# EAGLE design L9110_v1_1 (EAGLE 9.6.2)
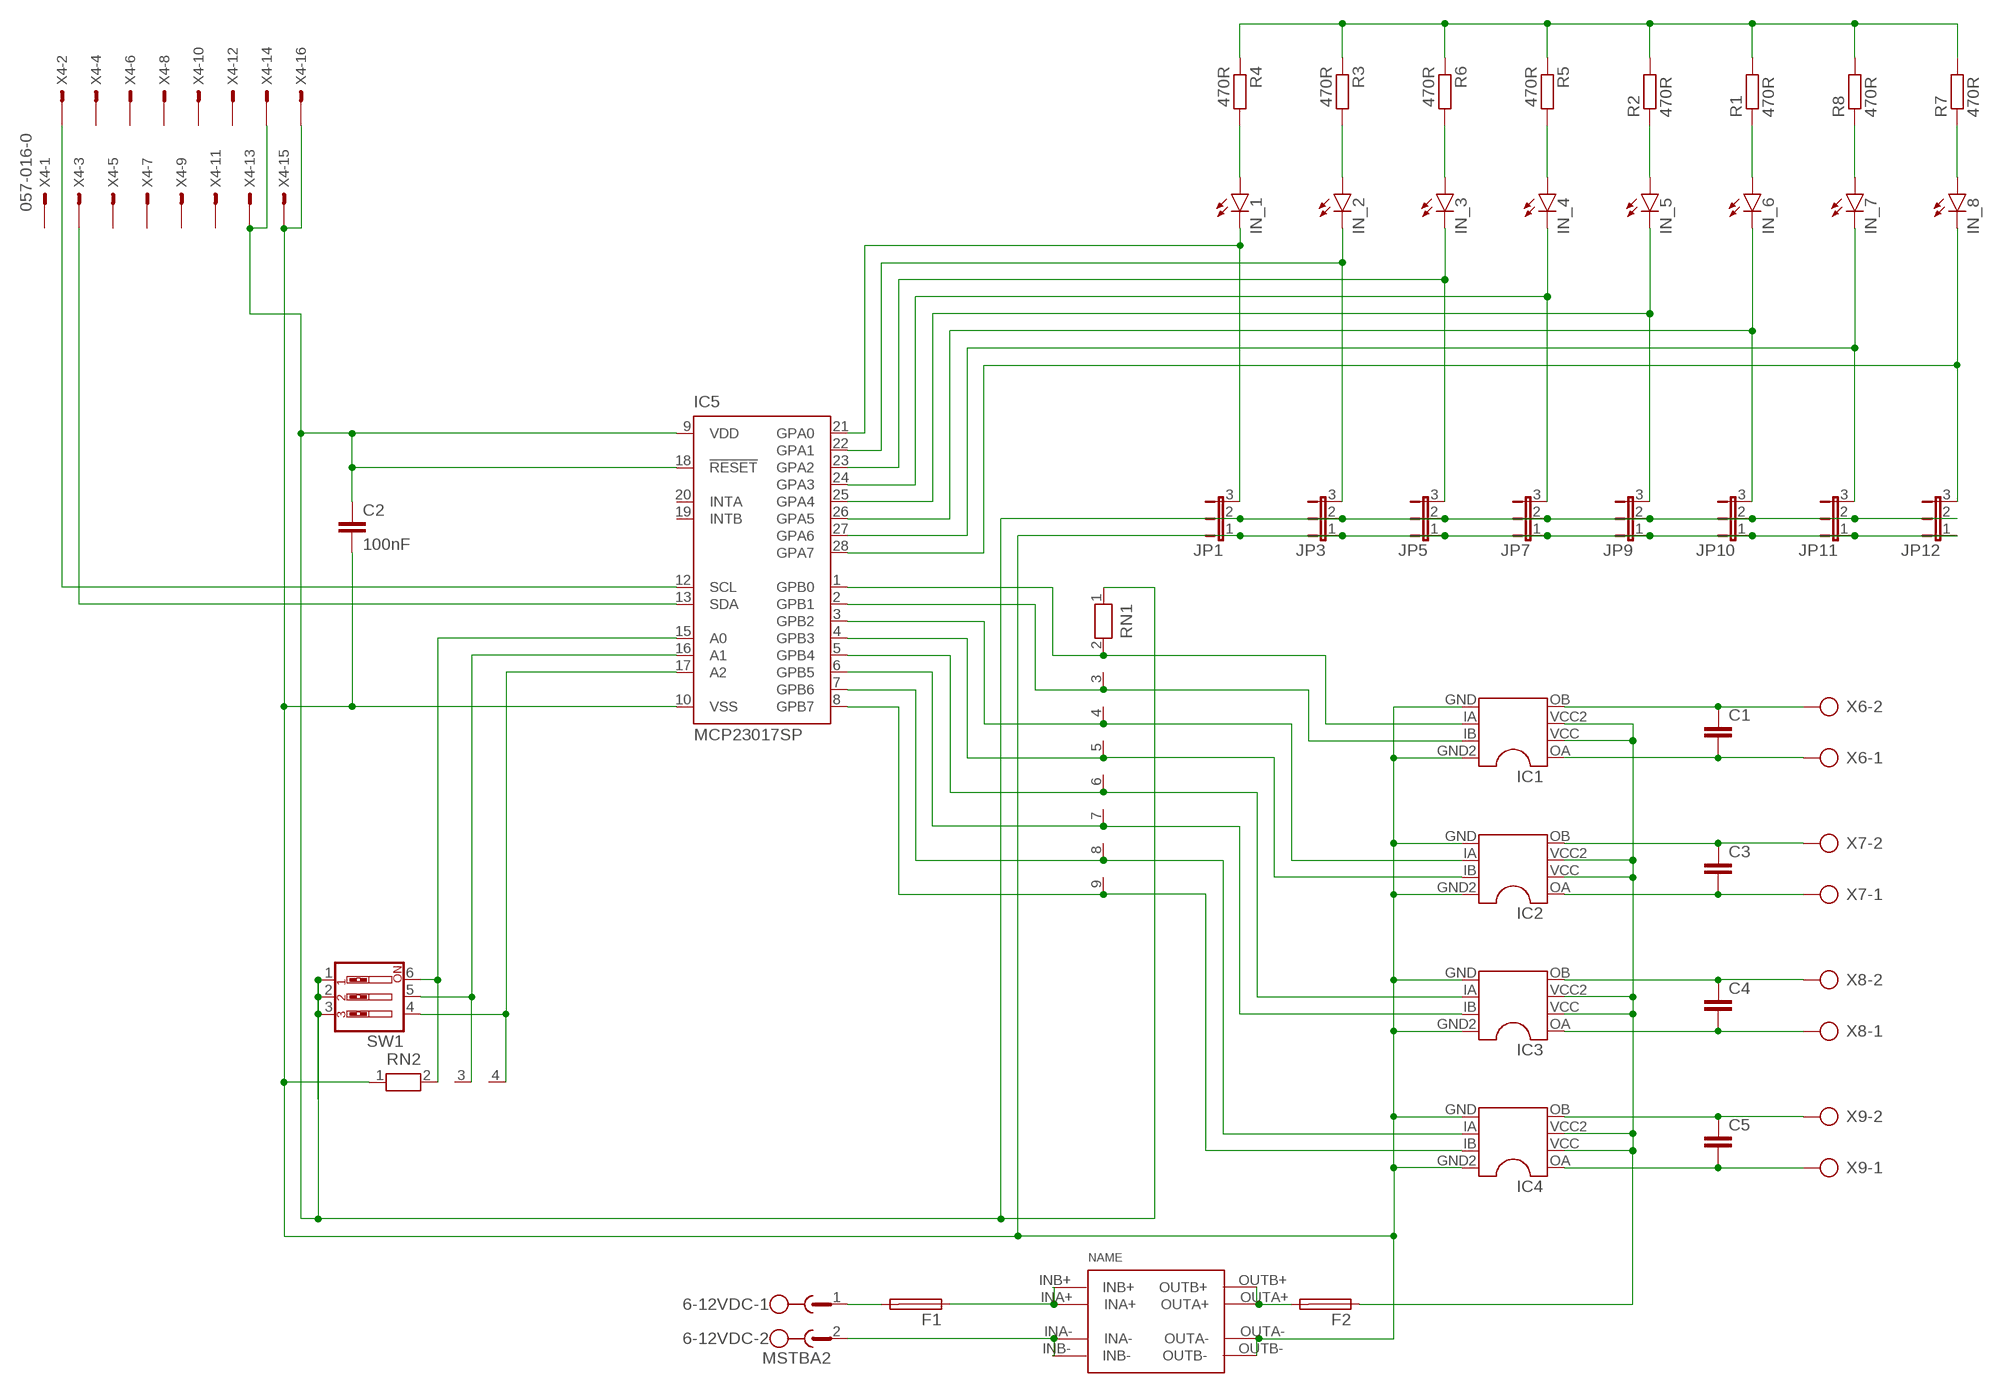
[diagram p0: schematic, sheet 1]

## Parts
6-12VDC  MSTBA2  [MSTBA2]
C1  C-EU025-024X044  [C025-024X044]
C2  100nF  C-EU025-024X044  [C025-024X044]
C3  C-EU025-024X044  [C025-024X044]
C4  C-EU025-024X044  [C025-024X044]
C5  C-EU025-024X044  [C025-024X044]
F1  SH22,5A  [SH22,5A]
F2  SH22,5A  [SH22,5A]
IC1  L9110  [L9110]
IC2  L9110  [L9110]
IC3  L9110  [L9110]
IC4  L9110  [L9110]
IC5  MCP23017SP  [DIL28-3]
IN_1  LED3MM  [LED3MM]
IN_2  LED3MM  [LED3MM]
IN_3  LED3MM  [LED3MM]
IN_4  LED3MM  [LED3MM]
IN_5  LED3MM  [LED3MM]
IN_6  LED3MM  [LED3MM]
IN_7  LED3MM  [LED3MM]
IN_8  LED3MM  [LED3MM]
JP1  JP2E  [JP2]
JP3  JP2E  [JP2]
JP5  JP2E  [JP2]
JP7  JP2E  [JP2]
JP9  JP2E  [JP2]
JP10  JP2E  [JP2]
JP11  JP2E  [JP2]
JP12  JP2E  [JP2]
R1  470R  R-EU_0309/10  [0309/10]
R2  470R  R-EU_0309/10  [0309/10]
R3  470R  R-EU_0309/10  [0309/10]
R4  470R  R-EU_0309/10  [0309/10]
R5  470R  R-EU_0309/10  [0309/10]
R6  470R  R-EU_0309/10  [0309/10]
R7  470R  R-EU_0309/10  [0309/10]
R8  470R  R-EU_0309/10  [0309/10]
RN1  RN08  [RN-9]
RN2  RN03  [RN-3]
SW1  SW_DIP-3  [EDG-03]
U$2  CP8-ADJ-B  [CP8-ADJ-B]
X4  057-016-0  [057-016-0]
X6  AK300/2  [AK300/2]
X7  AK300/2  [AK300/2]
X8  AK300/2  [AK300/2]
X9  AK300/2  [AK300/2]

## Nets
GND2: C2.2 IC1.GND IC1.GND2 IC2.GND IC2.GND2 IC3.GND IC3.GND2 IC4.GND IC4.GND2 IC5.10(VSS) JP1.1 JP3.1 JP5.1 JP7.1 JP9.1 JP10.1 JP11.1 JP12.1 RN2.1 U$2.OUTA- U$2.OUTB- X4.15 X4.16
N$1: IC1.IA IC5.1(GPB0) RN1.2
N$2: IC5.22(GPA1) IN_2.K(C) JP3.3
N$3: IC1.IB IC5.2(GPB1) RN1.3
N$4: IC5.24(GPA3) IN_4.K(C) JP7.3
N$5: IC2.IA IC5.3(GPB2) RN1.4
N$6: IC5.17(A2) RN2.4 SW1.4
N$7: IC5.26(GPA5) IN_6.K(C) JP10.3
N$8: IC2.IB IC5.4(GPB3) RN1.5
N$9: IC5.28(GPA7) IN_8.K(C) JP12.3
N$10: IN_8.A R7.1
N$11: IN_7.A R8.1
N$12: IC3.IA IC5.5(GPB4) RN1.6
N$13: IN_6.A R1.1
N$14: IC3.IB IC5.6(GPB5) RN1.7
N$15: IC4.IA IC5.7(GPB6) RN1.8
N$16: IC4.IB IC5.8(GPB7) RN1.9
N$17: C1.1 IC1.OB X6.2
N$18: F2.1 IC1.VCC IC1.VCC2 IC2.VCC IC2.VCC2 IC3.VCC IC3.VCC2 IC4.VCC IC4.VCC2
N$19: C1.2 IC1.OA X6.1
N$20: C3.1 IC2.OB X7.2
N$21: IC5.21(GPA0) IN_1.K(C) JP1.3
N$22: C3.2 IC2.OA X7.1
N$23: IC5.23(GPA2) IN_3.K(C) JP5.3
N$24: C4.1 IC3.OB X8.2
N$25: IC5.25(GPA4) IN_5.K(C) JP9.3
N$26: C4.2 IC3.OA X8.1
N$27: IC5.27(GPA6) IN_7.K(C) JP11.3
N$28: C5.1 IC4.OB X9.2
N$29: IN_5.A R2.1
N$30: IN_4.A R5.2
N$31: IN_3.A R6.2
N$32: IN_2.A R3.2
N$33: IN_1.A R4.2
N$34: C5.2 IC4.OA X9.1
N$35: IC5.16(A1) RN2.3 SW1.5
N$36: 6-12VDC.1 F1.2
N$37: F1.1 U$2.INA+ U$2.INB+
N$38: 6-12VDC.2 U$2.INA- U$2.INB-
N$39: F2.2 U$2.OUTA+ U$2.OUTB+
N$82: IC5.12(SCL) X4.2
N$84: IC5.13(SDA) X4.3
N$85: IC5.15(A0) RN2.2 SW1.6
VCC5.1: C2.1 IC5.9(VDD) IC5.18(!RESET) JP1.2 JP3.2 JP5.2 JP7.2 JP9.2 JP10.2 JP11.2 JP12.2 RN1.1 SW1.1 SW1.2 SW1.3 X4.13 X4.14
VCC5.2: R1.2 R2.2 R3.1 R4.1 R5.1 R6.1 R7.2 R8.2
Unconnected: IC5.19(INTB) IC5.20(INTA) X4.1 X4.4 X4.5 X4.6 X4.7 X4.8 X4.9 X4.10 X4.11 X4.12

## Library data of the parts
6-12VDC = con-phoenix-508:MSTBA2: PHOENIX; MF: FARNELL; MPN: 1757242; OC_FARNELL: 3705171; OC_NEWARK: 71C4161
C1-C5 = resistor:C-EU: CAPACITOR, European symbol
F1 F2 = fuse:SH22,5A: FUSE HOLDER grid 22,5mm, isolated cap OGN0031 8201, Schurter (Buerklin); MPN: 0031.7701.11; OC_FARNELL: unknown; OC_NEWARK: 04F1224
IC1-IC4 = kevin:L9110: Dual In Line / Socket
IC5 = microchip-6:MCP23017: http://ww1.microchip.com/downloads/en/DeviceDoc/21952a.pdf Source: http://ww1.microchip.com/downloads/en/DeviceDoc/21952a.pdf
IN_1-IN_8 = led:LED: LED OSRAM: - CHIPLED LG R971, LG N971, LY N971, LG Q971, LY Q971, LO R971, LY R971 LH N974, LH R974 LS Q976, LO Q976, LY Q976 LO Q996 - Hyper CHIPLED LW Q18S LB Q993, LB Q99A, LB R99A - SideLED LS A670, LO A670, LY A670, LG A670, LP A670 LB A673, LV A673, LT A673, LW A673 LH A674 LY A675 LS A676, LA A676, LO A676, LY A676, LW A676 LS A679, LY A679, LG A679 - Hyper Micro SIDELED® LS Y876, LA Y876, LO Y876, LY Y876 LT Y87S - SmartLED LW L88C, LW L88S LB L89C, LB L89S, LG L890 LS L89K, LO L89K, LY L89K LS L896, LA L896, LO L896, LY L896 - TOPLED LS T670, LO T670, LY T670, LG T670, LP T670 LSG T670, LSP T670, LSY T670, LOP T670, LYG T670 LG T671, LOG T671, LSG T671 LB T673, LV T673, LT T673, LW T673 LH T674 LS T676, LA T676, LO T676, LY T676, LB T676, LH T676, LSB T676, LW T676 LB T67C, LV T67C, LT T67C, LS T67K, LO T67K, LY T67K, LW E67C LS E67B, LA E67B, LO E67B, LY E67B, LB E67C, LV E67C, LT E67C LW T67C LS T679, LY T679, LG T679 LS T770, LO T770, LY T770, LG T770, LP T770 LB T773, LV T773, LT T773, LW T773 LH T774 LS E675, LA E675, LY E675, LS T675 LS T776, LA T776, LO T776, LY T776, LB T776 LHGB T686 LT T68C, LB T68C - Hyper Mini TOPLED® LB M676 - Mini TOPLED Santana® LG M470 LS M47K, LO M47K, LY M47K Source: http://www.osram.convergy.de LUXEON: - LUMILED® LXK2-PW12-R00, LXK2-PW12-S00, LXK2-PW14-U00, LXK2-PW14-V00 LXK2-PM12-R00, LXK2-PM12-S00, LXK2-PM14-U00 LXK2-PE12-Q00, LXK2-PE12-R00, LXK2-PE12-S00, LXK2-PE14-T00, LXK2-PE14-U00 LXK2-PB12-K00, LXK2-PB12-L00, LXK2-PB12-M00, LXK2-PB14-N00, LXK2-PB14-P00, LXK2-PB14-Q00 LXK2-PR12-L00, LXK2-PR12-M00, LXK2-PR14-Q00, LXK2-PR14-R00 LXK2-PD12-Q00, LXK2-PD12-R00, LXK2-PD12-S00 LXK2-PH12-R00, LXK2-PH12-S00 LXK2-PL12-P00, LXK2-PL12-Q00, LXK2-PL12-R00 Source: www.luxeon.com KINGBRIGHT: KA-3528ASYC Source: www.kingbright.com
JP1 JP3 JP5 JP7 JP9-JP12 = jumper:JP2E: JUMPER
R1-R8 = resistor:R-EU_: RESISTOR, European symbol
RN1 = resistor-net_edit:RN08: RESISTOR NETWORK; OC_FARNELL: unknown; OC_NEWARK: unknown
RN2 = resistor-net_edit:RN03: RESISTOR NETWORK; OC_FARNELL: unknown; OC_NEWARK: unknown
SW1 = special:SW_DIP-3: DIP SWITCH
U$2 = userlib:CP8-ADJ-B: Voltage regulator IN: 7-35V OUT: ADJ
X4 = con-panduit:057-016-: CONNECTOR 10-pin series 057 contact pc board low profile headers; OC_FARNELL: unknown; OC_NEWARK: unknown
X6-X9 = con-ptr500:AK300/2: CONNECTOR; OC_FARNELL: unknown; OC_NEWARK: unknown

## Board
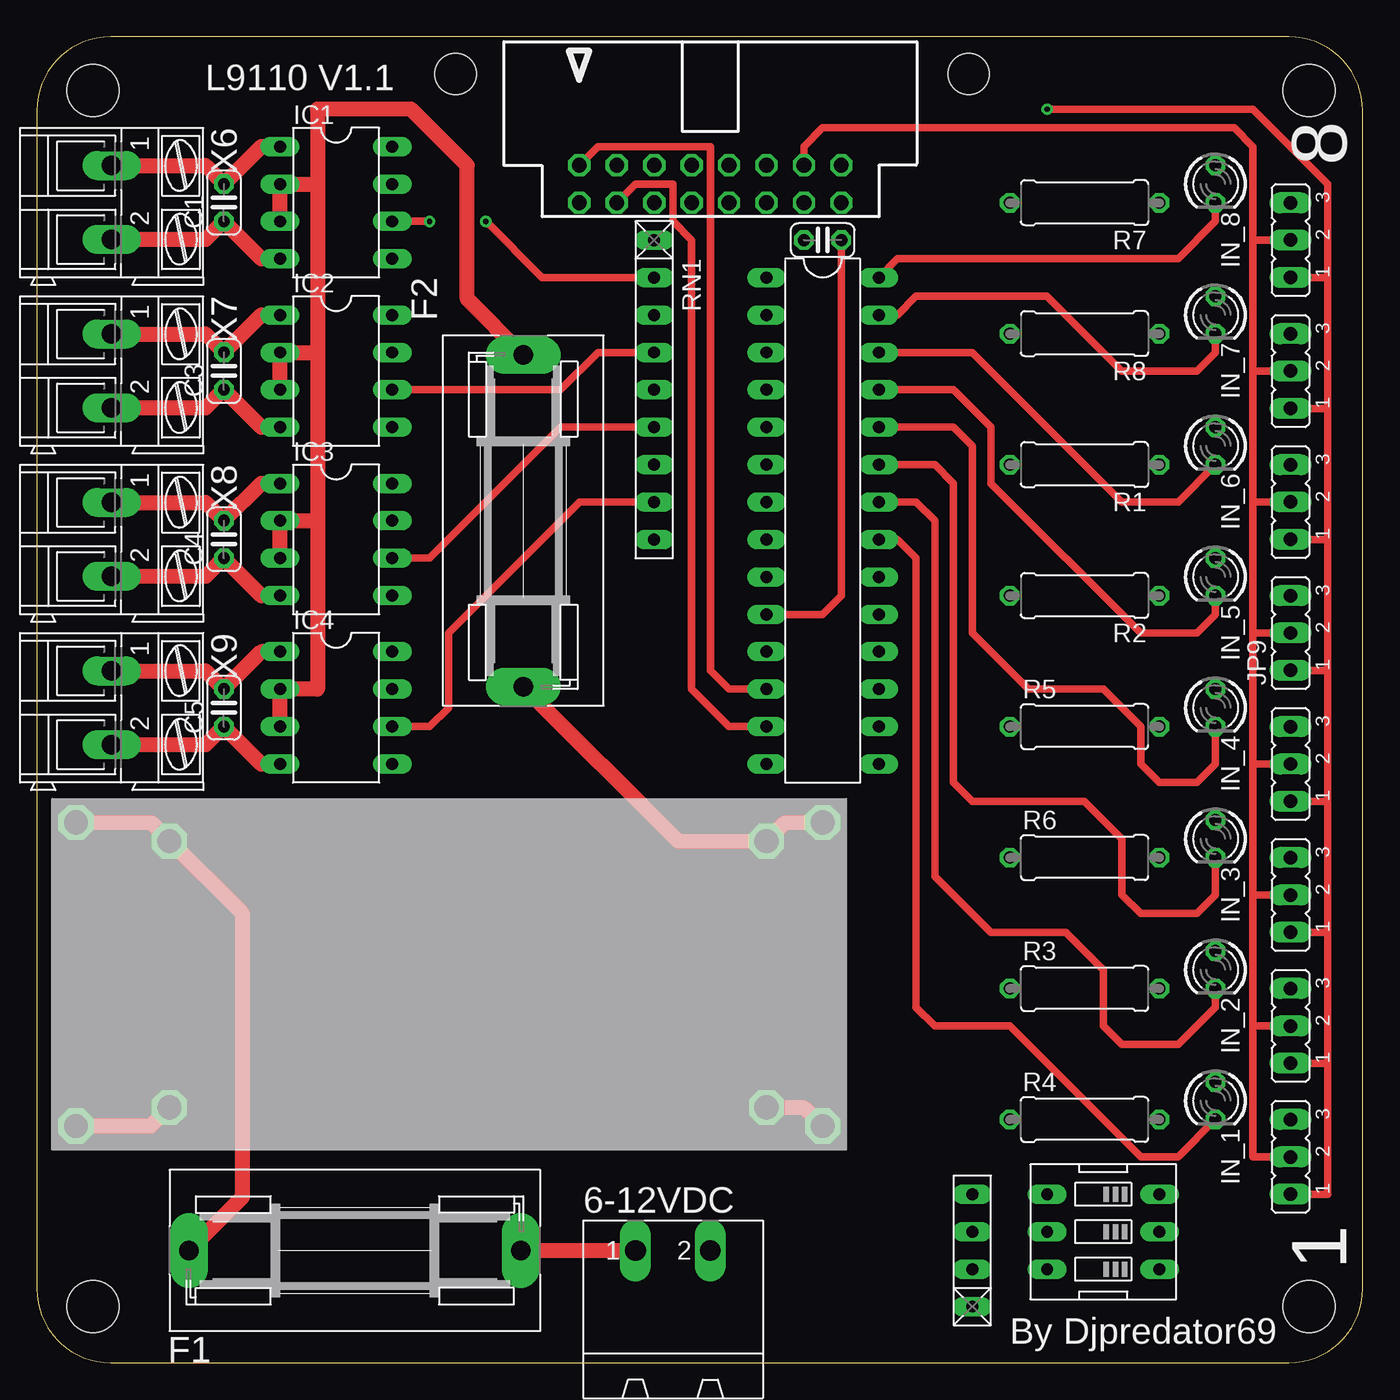
[diagram p1: board, top side]
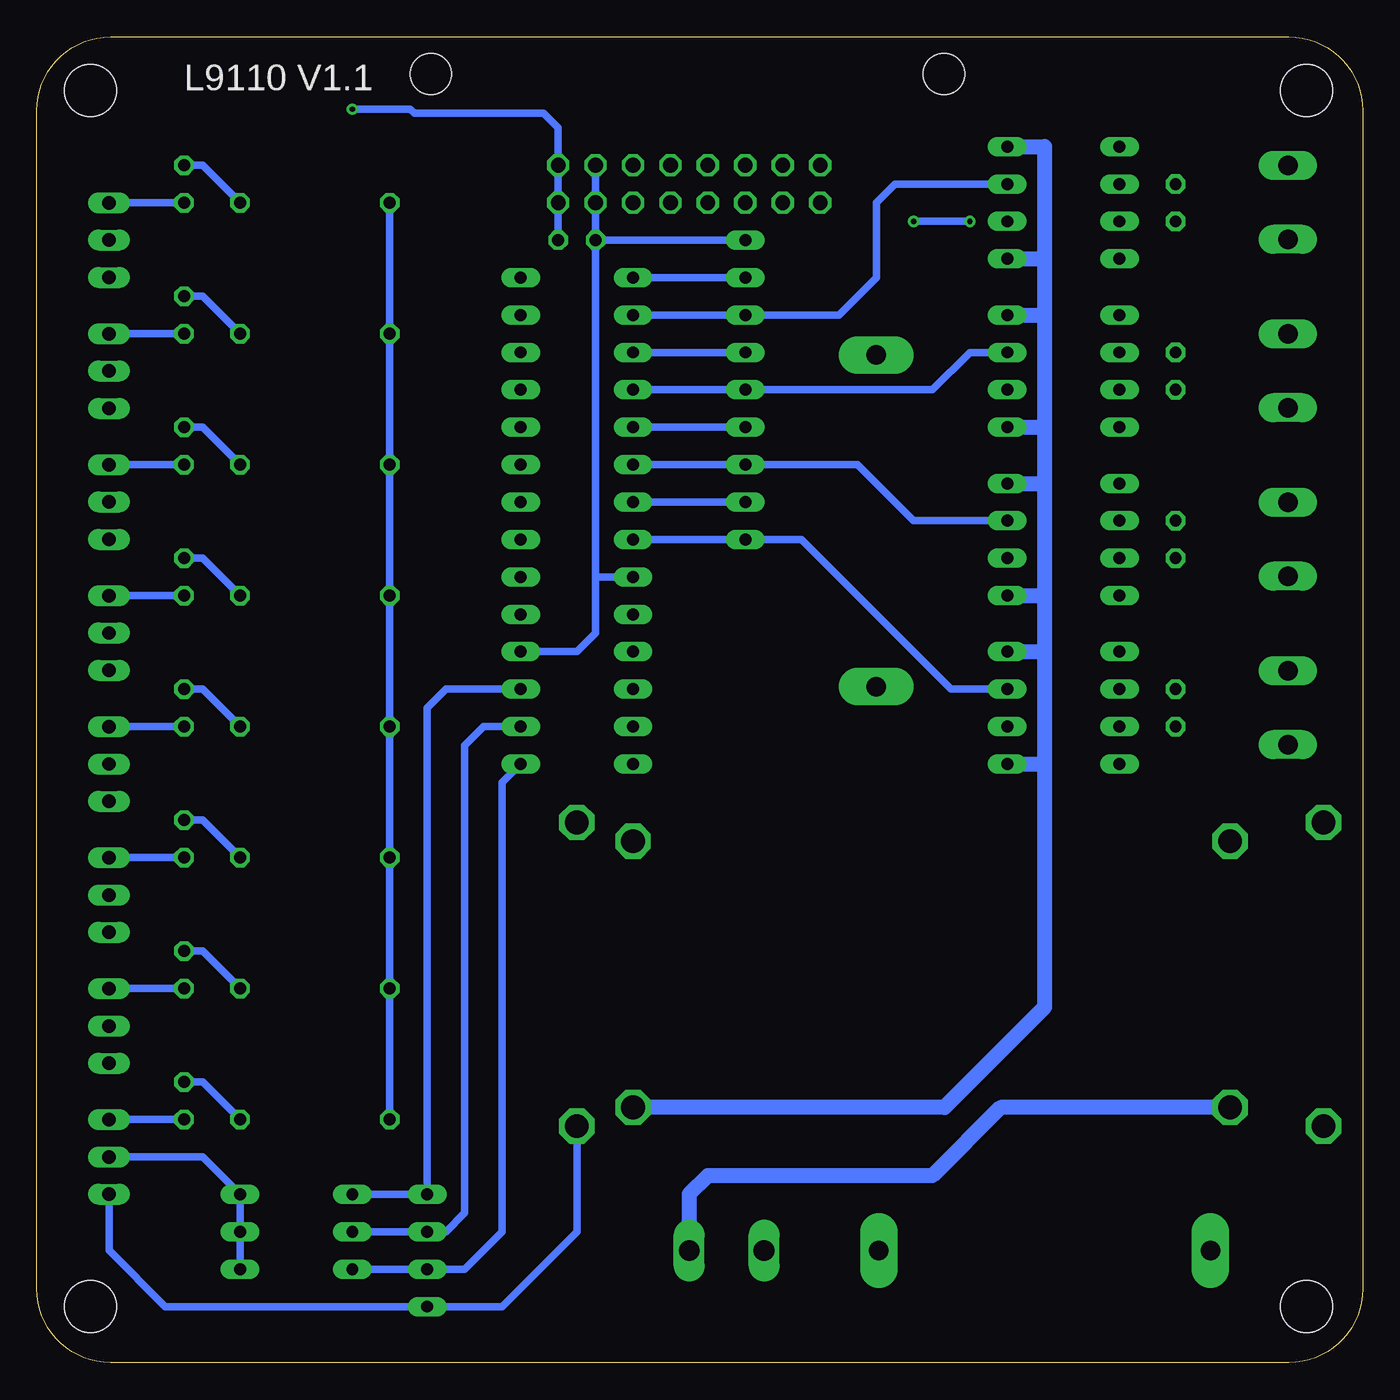
[diagram p2: board, bottom side, seen from below]

Size 90 x 90 mm. Coordinates in mm from the lower left corner, seen from the top.
Outline: 0,85 0,5 arc90 5,0 85,0 arc90 90,5 90,85 arc90 85,90 5,90 arc90 0,85
Copper layers (1*16): Top 0.035mm / dielectric 1.5mm / Bottom 0.035mm
Design rules "default": minimum track width 6mil, minimum drill 0.35mm, track to track 6mil, track to pad 6mil, pad to pad 6mil, via to via 6mil, smd to smd 6mil, copper to edge 40mil, drill to drill 6mil, minimum pad ring 10mil, minimum via ring 8mil, stop-mask expansion 4mil, vias tented up to drill 0mil, thermal gap 10mil
Holes 3.5 mm at 86.36,86.36 3.81,86.36 3.81,3.81 86.36,3.81

### Footprints (pad centres in the part's own frame; a part is rotated, then mirrored left to right if it is on the bottom)
MSTBA2 = drill 1.397 long: 1 -2.54,5.08; 2 2.54,5.08
C025-024X044 = drill 0.813 octagon: 1 -1.27,0; 2 1.27,0
SH22,5A = drill 1.321 pad 2.54 long: 1 -11.252,0; 2 11.252,0
L9110 = drill 0.813 long: GND 3.81,3.81; GND2 -3.81,3.81; IA 1.27,3.81; IB -1.27,3.81; OA -3.81,-3.81; OB 3.81,-3.81; VCC -1.27,-3.81; VCC2 1.27,-3.81
DIL28-3 = drill 0.813 long: 1 -16.51,-3.81; 2 -13.97,-3.81; 3 -11.43,-3.81; 4 -8.89,-3.81; 5 -6.35,-3.81; 6 -3.81,-3.81; 7 -1.27,-3.81; 8 1.27,-3.81; 9 3.81,-3.81; 10 6.35,-3.81; 11 8.89,-3.81; 12 11.43,-3.81; 13 13.97,-3.81; 14 16.51,-3.81; 15 16.51,3.81; 16 13.97,3.81; 17 11.43,3.81; 18 8.89,3.81; 19 6.35,3.81; 20 3.81,3.81; 21 1.27,3.81; 22 -1.27,3.81; 23 -3.81,3.81; 24 -6.35,3.81; 25 -8.89,3.81; 26 -11.43,3.81; 27 -13.97,3.81; 28 -16.51,3.81
LED3MM = drill 0.813 octagon: A -1.27,0; K 1.27,0
JP2 = drill 0.914 long: 1 -2.54,0; 2 0,0; 3 2.54,0
0309/10 = drill 0.813 octagon: 1 -5.08,0; 2 5.08,0
RN-9 = drill 0.813 long: 1 -10.16,0; 2 -7.62,0; 3 -5.08,0; 4 -2.54,0; 5 0,0; 6 2.54,0; 7 5.08,0; 8 7.62,0; 9 10.16,0
RN-3 = drill 0.813 long: 1 -5.08,0; 2 -2.54,0; 3 0,0; 4 2.54,0
EDG-03 = drill 0.813 long: 1 -2.54,-3.81; 2 0,-3.81; 3 2.54,-3.81; 4 2.54,3.81; 5 0,3.81; 6 -2.54,3.81
CP8-ADJ-B = drill 1.6 octagon: INA+ -19.27,8.32; INA- -19.27,-9.75; INB+ -25.62,9.59; INB- -25.62,-11.02; OUTA+ 21.26,8.32; OUTA- 21.26,-9.75; OUTB+ 25.07,9.59; OUTB- 25.07,-11.02
057-016-0 = drill 1 octagon: 1 -8.89,-5.08; 2 -8.89,-2.54; 3 -6.35,-5.08; 4 -6.35,-2.54; 5 -3.81,-5.08; 6 -3.81,-2.54; 7 -1.27,-5.08; 8 -1.27,-2.54; 9 1.27,-5.08; 10 1.27,-2.54; 11 3.81,-5.08; 12 3.81,-2.54; 13 6.35,-5.08; 14 6.35,-2.54; 15 8.89,-5.08; 16 8.89,-2.54 | hole 2.8: -17.29,3.66; 17.54,3.66
AK300/2 = drill 1.321 long: 1 -2.515,0; 2 2.489,0

### Placement (x,y rotation side)
6-12VDC  43.18,2.54 0 top
C1  12.7,78.74 90 top
C2  53.34,76.2 0 top
C3  12.7,67.31 90 top
C4  12.7,55.88 90 top
C5  12.7,44.45 90 top
F1  21.59,7.62 0 top
F2  33.02,57.15 270 top
IC1  20.32,78.74 270 top
IC2  20.32,67.31 270 top
IC3  20.32,55.88 270 top
IC4  20.32,44.45 270 top
IC5  53.34,57.15 270 top
IN_1  80.01,17.78 270 top
IN_2  80.01,26.67 270 top
IN_3  80.01,35.56 270 top
IN_4  80.01,44.45 270 top
IN_5  80.01,53.34 270 top
IN_6  80.01,62.23 270 top
IN_7  80.01,71.12 270 top
IN_8  80.01,80.01 270 top
JP1  85.09,13.97 90 top
JP3  85.09,22.86 90 top
JP5  85.09,31.75 90 top
JP7  85.09,40.64 90 top
JP9  85.09,49.53 90 top
JP10  85.09,58.42 90 top
JP11  85.09,67.31 90 top
JP12  85.09,76.2 90 top
R1  71.12,60.96 180 top
R2  71.12,52.07 180 top
R3  71.12,25.4 0 top
R4  71.12,16.51 0 top
R5  71.12,43.18 0 top
R6  71.12,34.29 0 top
R7  71.12,78.74 180 top
R8  71.12,69.85 180 top
RN1  41.91,66.04 270 top
RN2  63.5,8.89 90 top
SW1  72.39,8.89 90 top
U$2  28.27,27.08 0 top
X4  45.72,83.82 0 top
X6  5.08,78.74 270 top
X7  5.08,67.31 270 top
X8  5.08,55.88 270 top
X9  5.08,44.45 270 top

### Tracks (layer width: path | path; a pad name or v marks a point on that pad's centre or on a via)
GND2  (via drill 0.35)
  Top 0.508: JP1.1 87.63,11.43 87.63,20.32 | 87.63,20.32 87.63,29.21 | 87.63,29.21 87.63,38.1 | 87.63,38.1 87.63,46.99 | 87.63,46.99 87.63,55.88 | 87.63,55.88 87.63,64.77 | 87.63,64.77 87.63,73.66 | 87.63,73.66 JP12.1 | JP11.1 87.63,64.77 | JP10.1 87.63,55.88 | JP9.1 87.63,46.99 | JP7.1 87.63,38.1 | JP5.1 87.63,29.21 | JP3.1 87.63,20.32 | 87.63,73.66 87.63,80.01 82.55,85.09 v68.58,85.09 | IC5.10 53.34,50.8 54.61,52.07 C2.2
  Top 1.016: U$2.OUTA- 52.07,17.33 U$2.OUTB-
  Bottom 0.508: U$2.OUTB- 53.34,8.89 58.42,3.81 RN2.1 81.28,3.81 85.09,7.62 JP1.1 | C2.2 X4.15 X4.16 54.61,83.82 55.6,84.81 64.37,84.81 64.65,85.09 v68.58,85.09
  Bottom 1.016: IC1.GND2 21.59,82.55 21.59,74.93 | 21.59,74.93 21.59,71.12 | 21.59,71.12 21.59,63.5 | 21.59,63.5 21.59,59.69 | 21.59,59.69 21.59,52.07 | 21.59,52.07 21.59,48.26 | 21.59,48.26 21.59,40.64 | IC1.GND 21.59,74.93 | IC2.GND2 21.59,71.12 | IC2.GND 21.59,63.5 | IC3.GND2 21.59,59.69 | IC3.GND 21.59,52.07 | IC4.GND2 21.59,48.26 | IC4.GND 21.59,40.64 | 21.59,40.64 21.59,24.13 28.39,17.33 U$2.OUTA-
N$1  (via drill 0.35)
  Top 0.508: IC1.IA v26.67,77.47 | v30.48,77.47 34.29,73.66 RN1.2
  Bottom 0.508: RN1.2 IC5.1 | v26.67,77.47 v30.48,77.47
N$2
  Top 0.508: IC5.22 59.69,58.42 60.96,57.15 60.96,33.02 64.77,29.21 69.85,29.21 72.39,26.67 72.39,22.86 73.66,21.59 77.47,21.59 80.01,24.13 IN_2.K
  Bottom 0.508: IN_2.K JP3.3
N$3
  Bottom 0.508: IC5.2 RN1.3 35.56,71.12 33.02,73.66 33.02,78.74 31.75,80.01 IC1.IB
N$4
  Top 0.508: IC5.24 62.23,63.5 63.5,62.23 63.5,49.53 67.31,45.72 72.39,45.72 74.93,43.18 74.93,40.64 76.2,39.37 78.74,39.37 80.01,40.64 IN_4.K
  Bottom 0.508: IN_4.K JP7.3
N$5
  Top 0.508: IC2.IA 35.56,66.04 38.1,68.58 RN1.4
  Bottom 0.508: RN1.4 IC5.3
N$6
  Bottom 0.508: SW1.4 RN2.4 63.5,44.45 62.23,45.72 IC5.17
N$7
  Top 0.508: IC5.26 63.5,68.58 73.66,58.42 77.47,58.42 IN_6.K
  Bottom 0.508: IN_6.K JP10.3
N$8
  Bottom 0.508: IC5.4 RN1.5 29.21,66.04 26.67,68.58 IC2.IB
N$9
  Top 0.508: IC5.28 58.42,74.93 77.47,74.93 80.01,77.47 IN_8.K
  Bottom 0.508: IN_8.K JP12.3
N$10
  Bottom 0.508: R7.1 78.74,81.28 IN_8.A
N$11
  Bottom 0.508: R8.1 78.74,72.39 IN_7.A
N$12
  Top 0.508: IC3.IA 26.67,54.61 35.56,63.5 RN1.6
  Bottom 0.508: RN1.6 IC5.5
N$13
  Bottom 0.508: R1.1 78.74,63.5 IN_6.A
N$14
  Bottom 0.508: IC5.6 RN1.7 34.29,60.96 30.48,57.15 IC3.IB
N$15
  Top 0.508: RN1.8 39.37,58.42 38.1,58.42 36.83,58.42 27.94,49.53 27.94,44.45 26.67,43.18 IC4.IA
  Bottom 0.508: RN1.8 IC5.7
N$16
  Bottom 0.508: IC5.8 RN1.9 38.1,55.88 27.94,45.72 IC4.IB
N$17
  Top 1.016: IC1.OB 15.24,74.93 C1.1 11.48,76.25 X6.2
N$18
  Top 1.016: F2.1 29.21,72.21 29.21,81.28 25.4,85.09 19.05,85.09 19.05,80.01 | 19.05,80.01 19.05,68.58 | 19.05,68.58 19.05,57.15 | 19.05,57.15 19.05,45.72 IC4.VCC IC4.VCC2 | IC3.VCC2 IC3.VCC 19.05,57.15 | IC2.VCC2 IC2.VCC 19.05,68.58 | IC1.VCC2 IC1.VCC 19.05,80.01
N$19
  Top 1.016: IC1.OA 15.24,82.55 C1.2 11.46,81.25 X6.1
N$20
  Top 1.016: IC2.OB 15.24,63.5 C3.1 11.48,64.82 X7.2
N$21
  Top 0.508: IN_1.K 77.47,13.97 74.93,13.97 66.04,22.86 60.96,22.86 59.69,24.13 59.69,54.61 58.42,55.88 IC5.21
  Bottom 0.508: IN_1.K JP1.3
N$22
  Top 1.016: IC2.OA 15.24,71.12 C3.2 11.46,69.83 X7.1
N$23
  Top 0.508: IC5.23 60.96,60.96 62.23,59.69 62.23,39.37 63.5,38.1 71.12,38.1 73.66,35.56 73.66,31.75 74.93,30.48 78.74,30.48 80.01,31.75 IN_3.K
  Bottom 0.508: IN_3.K JP5.3
N$24
  Top 1.016: IC3.OB 15.24,52.07 C4.1 11.48,53.39 X8.2
N$25
  Top 0.508: IC5.25 62.23,66.04 64.77,63.5 64.77,59.69 74.93,49.53 78.74,49.53 80.01,50.8 IN_5.K
  Bottom 0.508: IN_5.K JP9.3
N$26
  Top 1.016: IC3.OA 15.24,59.69 C4.2 11.46,58.4 X8.1
N$27
  Top 0.508: IC5.27 58.42,71.12 59.69,72.39 68.58,72.39 73.66,67.31 78.74,67.31 80.01,68.58 IN_7.K
  Bottom 0.508: IN_7.K JP11.3
N$28
  Top 1.016: IC4.OB 15.24,40.64 C5.1 11.48,41.96 X9.2
N$29
  Bottom 0.508: R2.1 78.74,54.61 IN_5.A
N$30
  Bottom 0.508: R5.2 78.74,45.72 IN_4.A
N$31
  Bottom 0.508: R6.2 78.74,36.83 IN_3.A
N$32
  Bottom 0.508: R3.2 78.74,27.94 IN_2.A
N$33
  Bottom 0.508: R4.2 78.74,19.05 IN_1.A
N$34
  Top 1.016: IC4.OA 15.24,48.26 C5.2 11.46,46.97 X9.1
N$35
  Bottom 0.508: SW1.5 RN2.3 62.23,8.89 60.96,10.16 60.96,41.91 59.69,43.18 IC5.16
N$36
  Top 1.016: F1.2 6-12VDC.1
N$37
  Top 1.016: F1.1 13.97,11.25 13.97,30.48 8.89,35.56 | 8.89,35.56 8.89,35.51 U$2.INA+ | U$2.INB+ 7.78,36.67 8.89,35.56
N$38
  Top 1.016: U$2.INB- 7.73,16.06 U$2.INA-
  Bottom 1.016: U$2.INA- 24.58,17.33 29.21,12.7 44.45,12.7 45.72,11.43 6-12VDC.2
N$39
  Top 1.016: F2.2 43.52,35.4 U$2.OUTA+ 50.8,36.67 U$2.OUTB+
N$82
  Top 0.508: X4.2 38.1,82.55 45.72,82.55 45.72,46.99 46.99,45.72 IC5.12
N$84
  Top 0.508: X4.3 40.64,80.01 43.18,80.01 43.18,77.47 44.45,76.2 44.45,45.72 46.99,43.18 IC5.13
N$85
  Bottom 0.508: SW1.6 RN2.2 60.96,6.35 58.42,8.89 58.42,39.37 IC5.15
VCC5.1
  Top 0.508: 82.55,67.31 82.55,76.2 | 82.55,67.31 82.55,58.42 | 82.55,58.42 82.55,49.53 | 82.55,49.53 JP9.2 | JP10.2 82.55,58.42 | JP11.2 82.55,67.31 | 82.55,49.53 82.55,40.64 | 82.55,40.64 82.55,31.75 | 82.55,31.75 82.55,22.86 | JP3.2 82.55,22.86 | JP5.2 82.55,31.75 | JP7.2 82.55,40.64 | JP1.2 82.55,13.97 82.55,22.86 | JP12.2 82.55,76.2 | 82.55,76.2 82.55,82.55 81.28,83.82 53.34,83.82 52.07,82.55 X4.14
  Bottom 0.508: X4.14 X4.13 C2.1 | RN1.1 C2.1 | SW1.1 SW1.2 SW1.3 78.74,13.97 JP1.2 | C2.1 52.07,53.34 | 52.07,53.34 IC5.9 | 52.07,53.34 52.07,49.53 53.34,48.26 IC5.18
VCC5.2
  Bottom 0.508: R7.2 R8.2 R1.2 R2.2 R5.1 R6.1 R3.1 R4.1

### Text on the board
tNames: L9110 V1.1 | 8 | 1 | By Djpredator69
bNames: L9110 V1.1